# EasyEDA Pro project ProPrj_ZC95_FrontPanel_v1_2.epro

# Board PCB1
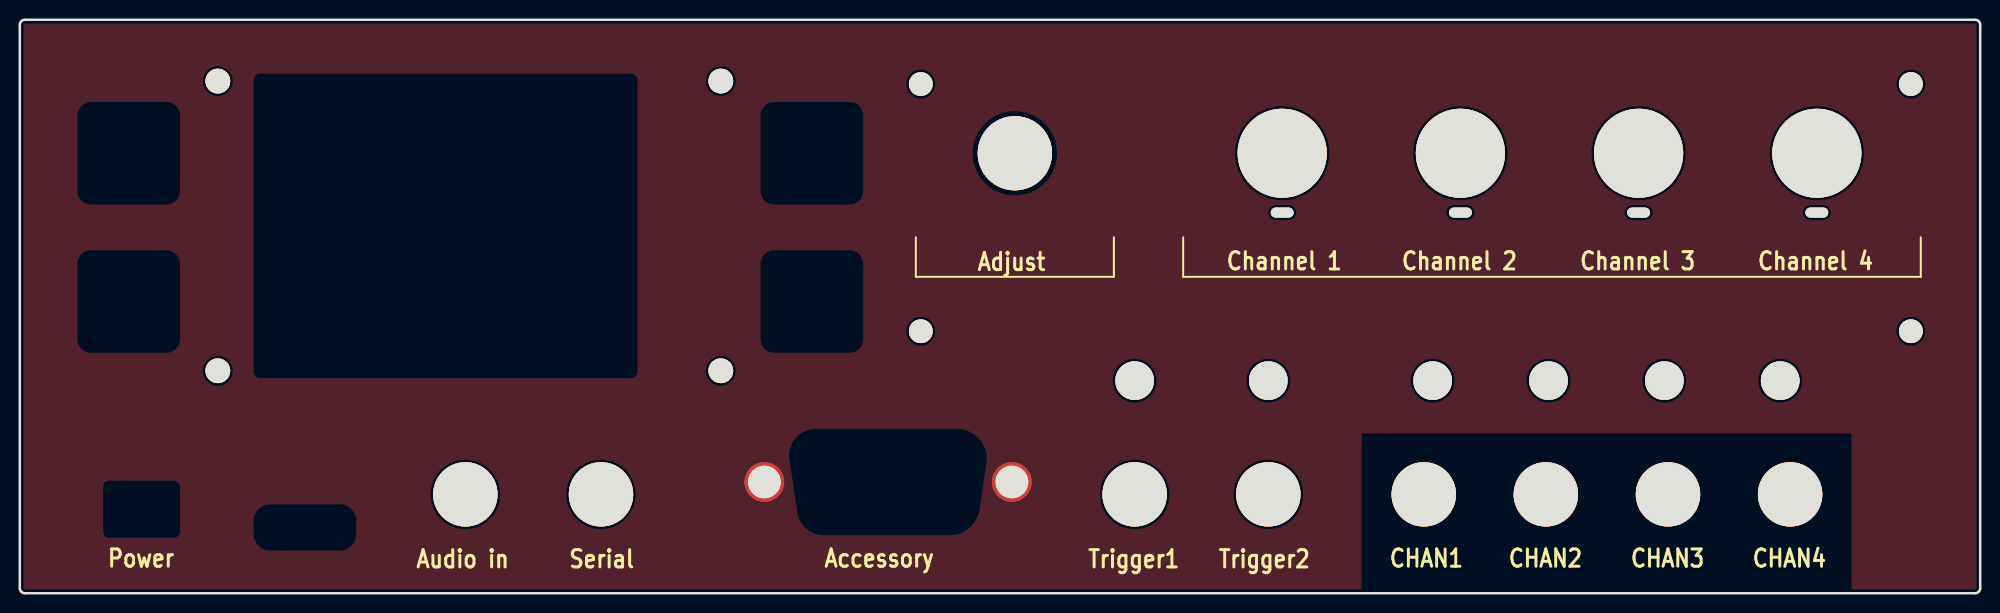
[diagram p0: board, top side]
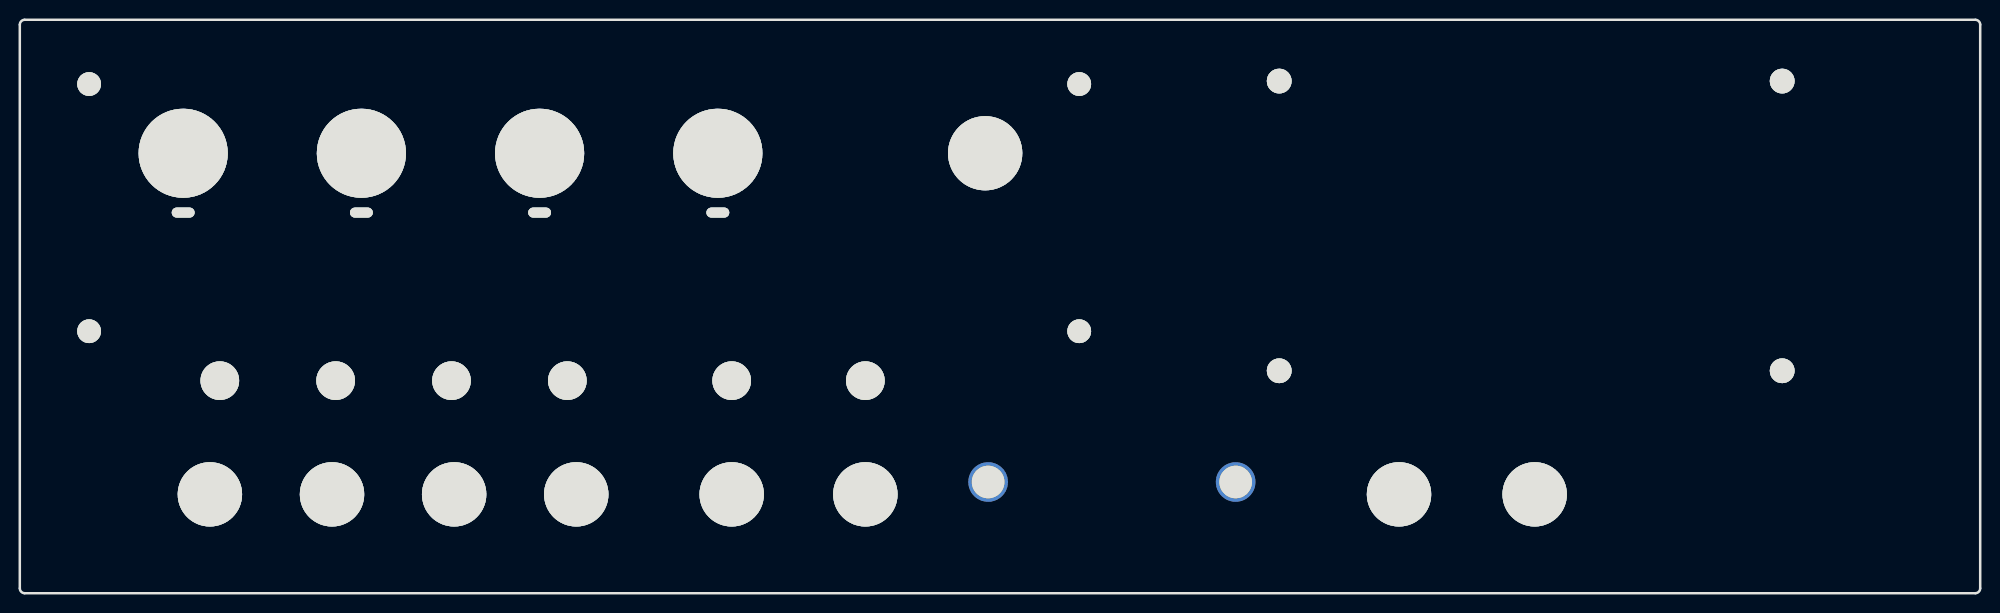
[diagram p1: board, bottom side, seen from below]

Outline 198 x 58 mm; copper layers: Top Layer, Bottom Layer. Coordinates in mm from the lower left corner of the outline.
Outline path: 0,57.5 0,0.5 arc(0.15,0.15) 0.5,0 197.5,0 arc(197.85,0.15) 198,0.5 198,57.5 arc(197.85,57.85) 197.5,58 0.5,58 arc(0.15,57.85) 0,57.5
Stack: Top Layer 0.035mm / Dielectric1 1.51mm FR4 er 4.5 / Bottom Layer 0.035mm

## Design rules (mm)
template: Custom Config
spacing copperThickness1oz (default): track to track 0.102, other pairs 0.152 to 0.3
spacing copperThickness2oz: track to track 0.203, other pairs 0.152 to 0.3
track width copperThickness1oz (default): min 0.127, default 0.254, max 2.54
track width copperThickness2oz: min 0.203, default 0.254, max 2.54
differential pair differentialPair (default): width min 0.127, default 0.254, max 2.54; gap min 0.152, default 0.152
via viaSize (default): diameter min 0.5, default 0.61, max 10; hole min 0.3, default 0.305, max 6.3

## Placement (name value [footprint] x y rotation side)
NOREF  -  [Pad_e23]  181.5 44.5 0 top
NOREF#2  -  [Pad_e7]  154.4 21.5 0 top
NOREF#3  -  [Pad_e27]  70.8 22.5 0 top
NOREF#4  -  [Pad_e16]  126.1 10 0 top
NOREF#5  -  [Pad_e30]  91 26.5 0 top
NOREF#6  -  [Pad_e24]  145.5 44.5 0 top
NOREF#7  -  [Pad_e6]  127.5 38.5 0 top
NOREF#8  -  [Pad_e21]  127.5 44.5 0 top
NOREF#9  -  [Pad_e12]  178.8 10 0 top
NOREF#10  -  [Pad_e40]  163.5 38.5 0 top
NOREF#11  -  [Pad_e18]  45 10 0 top
NOREF#12  -  [Pad_e99]  100.2 11.25 0 top
NOREF#13  -  [Pad_e25]  20 51.8 0 top
NOREF#14  -  [Pad_e5]  142.7 21.5 0 top
NOREF#15  -  [Pad_e19]  58.7 10 0 top
NOREF#16  -  [Pad_e31]  191 51.5 0 top
NOREF#17  -  [Pad_e17]  112.6 10 0 top
NOREF#18  -  [Pad_e39]  145.5 38.5 0 top
NOREF#19  -  [Pad_e9]  177.8 21.5 0 top
NOREF#20  -  [Pad_e26]  70.8 51.8 0 top
NOREF#21  -  [Pad_e14]  154.13 10 0 top
NOREF#22  -  [Pad_e8]  166.1 21.5 0 top
NOREF#23  -  [Pad_e96]  75.2 11.25 0 top
NOREF#24  -  [Pad_e22]  163.5 44.5 0 top
NOREF#25  -  [Pad_e32]  191 26.5 0 top
NOREF#26  -  [Pad_e13]  166.47 10 0 top
NOREF#27  -  [Pad_e41]  181.5 38.5 0 top
NOREF#28  -  [Pad_e10]  126.1 21.5 0 top
NOREF#29  -  [Pad_e20]  100.5 44.5 0 top
NOREF#30  -  [Pad_e15]  141.8 10 0 top
NOREF#31  -  [Pad_e29]  91 51.5 0 top
NOREF#32  -  [Pad_e11]  112.6 21.5 0 top
NOREF#33  -  [Pad_e28]  20 22.5 0 top

## Footprints (pads in the part's own frame, mm; a bottom-side part is the same pattern mirrored in y, then rotated)
Pad_e5
  round 3.9 hole 4.9x3.9: 1(0,0)
Pad_e6
  oval 2.3x1 hole 2.3x1: 1(0,0)
Pad_e7
  round 3.9 hole 4.9x3.9: 1(0,0)
Pad_e8
  round 3.9 hole 4.9x3.9: 1(0,0)
Pad_e9
  round 3.9 hole 4.9x3.9: 1(0,0)
Pad_e10
  round 3.9 hole 4.9x3.9: 1(0,0)
Pad_e11
  round 3.9 hole 4.9x3.9: 1(0,0)
Pad_e12
  round 6.5 hole 6.5: 1(0,0)
Pad_e13
  round 6.5 hole 6.5: 1(0,0)
Pad_e14
  round 6.5 hole 6.5: 1(0,0)
Pad_e15
  round 6.5 hole 6.5: 1(0,0)
Pad_e16
  round 6.5 hole 6.5: 1(0,0)
Pad_e17
  round 6.5 hole 6.5: 1(0,0)
Pad_e18
  round 6.5 hole 6.5: 1(0,0)
Pad_e19
  round 6.5 hole 6.5: 1(0,0)
Pad_e20
  round 7.5 hole 8: 1(0,0)
Pad_e21
  round 9 hole 9: 1(0,0)
Pad_e22
  round 9 hole 9: 1(0,0)
Pad_e23
  round 9 hole 9: 1(0,0)
Pad_e24
  round 9 hole 9: 1(0,0)
Pad_e25
  round 2.5 hole 2.5: 1(0,0)
Pad_e26
  round 2.5 hole 2.5: 1(0,0)
Pad_e27
  round 2.5 hole 2.5: 1(0,0)
Pad_e28
  round 2.5 hole 2.5: 1(0,0)
Pad_e29
  round 2.4 hole 2.4: 1(0,0)
Pad_e30
  round 2.4 hole 2.4: 1(0,0)
Pad_e31
  round 2.4 hole 2.4: 1(0,0)
Pad_e32
  round 2.4 hole 2.4: 1(0,0)
Pad_e39
  oval 2.3x1 hole 2.3x1: 1(0,0)
Pad_e40
  oval 2.3x1 hole 2.3x1: 1(0,0)
Pad_e41
  oval 2.3x1 hole 2.3x1: 1(0,0)
Pad_e96
  round 4 hole 3.3: 1(0,0)
Pad_e99
  round 4 hole 3.3: 1(0,0)

## Nets
GND: NOREF#12.1 NOREF#23.1

Pads without a net: NOREF 1; NOREF#2 1; NOREF#3 1; NOREF#4 1; NOREF#5 1; NOREF#6 1; NOREF#7 1; NOREF#8 1; NOREF#9 1; NOREF#10 1; NOREF#11 1; NOREF#13 1; NOREF#14 1; NOREF#15 1; NOREF#16 1; NOREF#17 1; NOREF#18 1; NOREF#19 1; NOREF#20 1; NOREF#21 1; NOREF#22 1; NOREF#24 1; NOREF#25 1; NOREF#26 1; NOREF#27 1; NOREF#28 1; NOREF#29 1; NOREF#30 1; NOREF#31 1; NOREF#32 1; NOREF#33 1

## Copper pours and planes (outline as drawn; the poured copper is in the pictures)
GND on Top Layer: 0.15,57.85 0.15,0.15 135.54,0.15 135.54,16.15 185,16.15 185,0 197.85,0 197.85,57.85

## Text on the board
Bottom Solder Mask Layer: ZC95 FrontPanel v1.2 (back)
Top Solder Mask Layer: ZC95 | MKII
Top Silkscreen Layer: Power | Audio in | Serial | Accessory | Adjust | Trigger1 | Trigger2 | Channel 1 | CHAN1 | Channel 2 | CHAN2 | Channel 3 | CHAN3 | CHAN4 | Channel 4
